# EAGLE schematic zoomm24_MRF_001 (EAGLE 5.11)

## Sheet 1 of 2
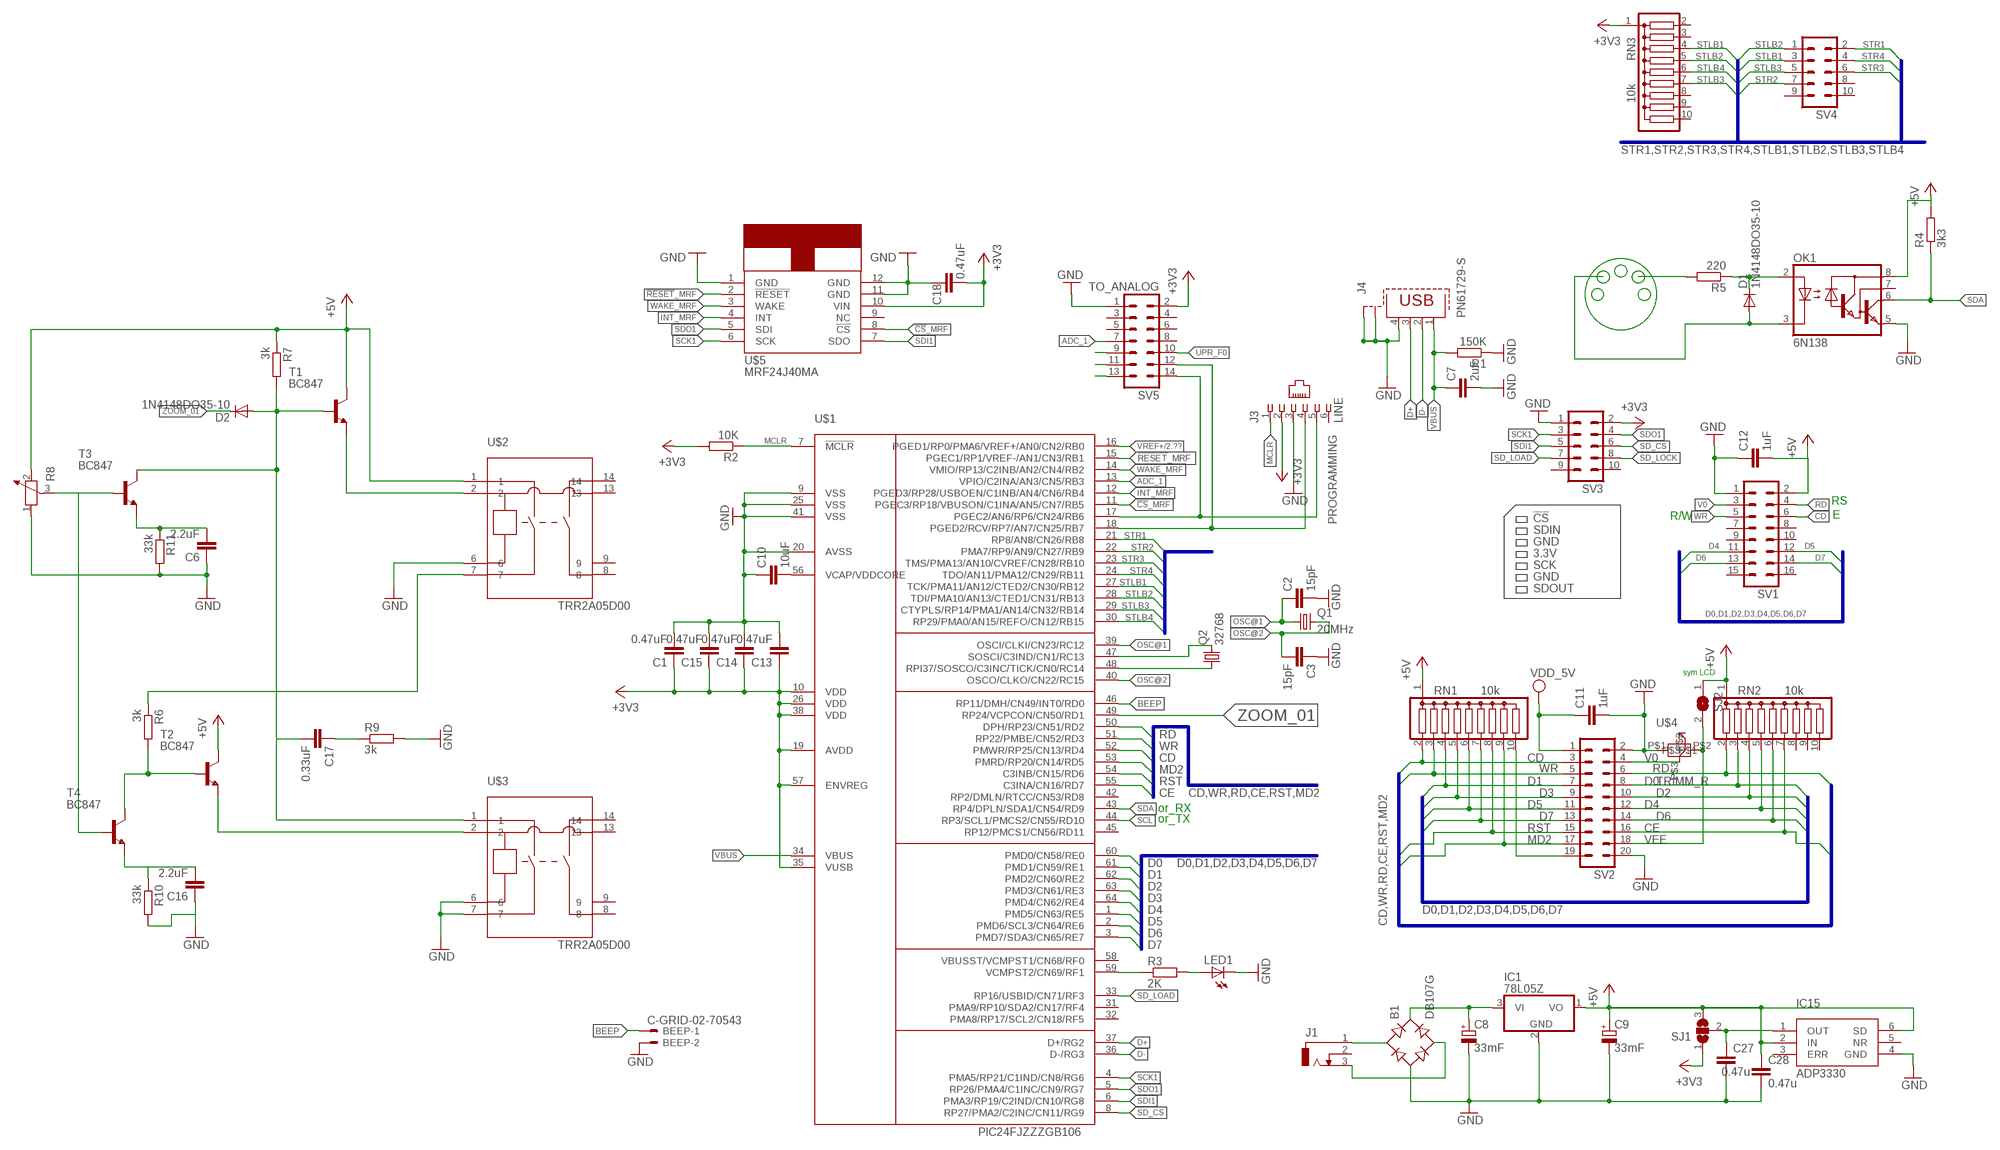
[diagram p0: schematic, sheet 1]

### Parts
B1  DB107G  [DB]
BEEP  C-GRID-02-70543  [70543-02]
C1  0.47uF  C-1206  [C1206]
C2  15pF  C-1206  [C1206]
C3  15pF  C-1206  [C1206]
C6  2.2uF  C-1206  [C1206]
C7  2uF  C-1206  [C1206]
C8  33mF  CPOL-EUE2.5-6  [E2,5-6]
C9  33mF  CPOL-EUE2.5-6  [E2,5-6]
C10  10uF  C-1206  [C1206]
C11  1uF  C-1206  [C1206]
C12  1uF  C-1206  [C1206]
C13  0.47uF  C-1206  [C1206]
C14  0.47uF  C-1206  [C1206]
C15  0.47uF  C-1206  [C1206]
C16  2.2uF  C-1206  [C1206]
C17  0.33uF  C-1206  [C1206]
C18  0.47uF  C-1206  [C1206]
C27  0.47u  C-EUC1206  [C1206]
C28  0.47u  C-EUC1206  [C1206]
D1  1N4148DO35-10  [DO35-10]
D2  1N4148DO35-10  [DO35-10]
IC1  78L05Z  [TO92]
IC15  ADP3330  [SOT-23-6]
J1  DCJ0303  [DCJ0303]
J3  LINE  520258-3  [520258-3]
J4  PN61729-S  [PN61729-S]
LED1  LED3MM  [LED3MM]
OK1  6N138  [DIL08]
Q1  20MHz  CRYSTALHC49S  [HC49/S]
Q2  32768  CRYSTALTC38H  [TC38H]
R1  150K  R-R1206  [R1206]
R2  10K  R-R1206  [R1206]
R3  2K  R-R1206  [R1206]
R4  3k3  R-EU_M1206  [M1206]
R5  220  R-EU_M1206  [M1206]
R6  3k  R-R1206  [R1206]
R7  3k  R-R1206  [R1206]
R8  POTENTIOMETER_PT-10  [PT-10]
R9  3k  R-R1206  [R1206]
R10  33k  R-R1206  [R1206]
R11  33k  R-R1206  [R1206]
RN1  10k  G09R  [SIL10]
RN2  10k  G09R  [SIL10]
RN3  10k  G09R  [SIL10]
SJ1  SJ2W  [SJ_2]
SJ2  SJ  [SJ]
SV1  ML16  [ML16]
SV2  ML20  [ML20]
SV3  ML10  [ML10]
SV4  ML10  [ML10]
SV5  TO_ANALOG  ML14  [ML14]
T1  BC847  [SOT23]
T2  BC847  [SOT23]
T3  BC847  [SOT23]
T4  BC847  [SOT23]
U$1  PIC24FJZZZGB106  [TQFP-64-PT-0.5MM]
U$2  TRR2A05D00  [TRR_DIP]
U$3  TRR2A05D00  [TRR_DIP]
U$4  TRIMM_R  [TRIMM_R]
U$5  MRF24J40MA  [MRF24J40MA]

### Nets
!CS!_MRF: U$1.11(PGEC3/RP18/VBUSON/C1INA/AN5/CN7/RB5) U$5.8(!CS)
!RESET!_MRF: U$1.15(PGEC1/RP1/VREF-/AN1/CN3/RB1) U$5.2(!RESET)
+3V3: C1.1 C13.1 C14.1 C15.1 C18.1 J3.2 R2.2 RN3.1 SJ1.1 SV3.2 SV5.2 U$1.10(VDD) U$1.19(AVDD) U$1.26(VDD) U$1.35(VUSB) U$1.38(VDD) U$1.57(ENVREG) U$5.10(VIN)
+5V: C9.+ C12.2 C28.1 IC1.1(VO) IC15.2(IN) IC15.6(SD) OK1.8(VCC) R4.2 R7.1 R8.2 RN1.1 RN2.1 SJ1.3 SJ2.1 SV1.2 T1.3(C) T2.3(C) U$2.1
ADC_1: SV5.7 U$1.13(VPIO/C2INA/AN3/CN5/RB3)
BEEP: BEEP.1 U$1.46(RP11/DMH/CN49/INT0/RD0)
CD: RN1.2 SV1.6 SV2.3 U$1.52(PMWR/RP25/CN13/RD4)
CE: RN2.7 SV2.16 U$1.55(C3INA/CN16/RD7)
CTR_0: SV5.9
CTR_1: SV5.11
CTR_2: SV5.13
D0: RN2.3 SV2.8 U$1.60(PMD0/CN58/RE0)
D1: RN1.4 SV2.7 U$1.61(PMD1/CN59/RE1)
D2: RN2.4 SV2.10 U$1.62(PMD2/CN60/RE2)
D3: RN1.5 SV2.9 U$1.63(PMD3/CN61/RE3)
D4: RN2.5 SV1.11 SV2.12 U$1.64(PMD4/CN62/RE4)
D5: RN1.6 SV1.12 SV2.11 U$1.1(PMD5/CN63/RE5)
D6: RN2.6 SV1.13 SV2.14 U$1.2(PMD6/SCL3/CN64/RE6)
D7: RN1.7 SV1.14 SV2.13 U$1.3(PMD7/SDA3/CN65/RE7)
D+: J4.3 U$1.37(D+/RG2)
D-: J4.2 U$1.36(D-/RG3)
GND: B1.- BEEP.2 C1.2 C2.2 C3.1 C6.1 C7.2 C8.- C9.- C10.1 C11.2 C12.1 C13.2 C14.2 C15.2 C16.1 C18.2 C27.2 C28.2 IC1.2(GND) IC15.4(GND) J3.3 J4.4 J4.S1 J4.S2 LED1.K(C) OK1.5(GND) R1.1 R8.1 R9.2 R10.2 R11.2 SV1.1 SV2.2 SV2.20 SV3.1 SV5.1 U$1.9(VSS) U$1.20(AVSS) U$1.25(VSS) U$1.41(VSS) U$2.6 U$3.6 U$3.7 U$4.P$1 U$5.1(GND) U$5.11(GND) U$5.12(GND) ; also sheet 2
INT_MRF: U$1.12(PGED3/RP28/USBOEN/C1INB/AN4/CN6/RB4) U$5.4(INT)
MCLR: J3.1 R2.1 U$1.7(!MCLR!)
MD2: RN1.9 SV2.17 U$1.53(PMRD/RP20/CN14/RD5)
N$1: T2.2(E) U$3.2
N$2: Q2.2 U$1.47(SOSCI/C3IND/CN1/RC13)
N$3: T1.2(E) U$2.2
N$4: D1.C OK1.2(A) R5.1
N$5: R5.2
N$6: D1.A OK1.3(C)
N$7: B1.AC1 J1.1
N$8: B1.AC2 J1.3
N$9: C17.2 D2.A R7.2 T1.1(B) T3.3(C) U$3.1
N$10: Q2.1 U$1.48(RPI37/SOSCO/C3INC/TICK/CN0/RC14)
N$11: C6.2 R11.1 T3.2(E)
N$12: C10.2 U$1.56(VCAP/VDDCORE)
N$13: C17.1 R9.1
N$14: RN1.10 SV2.19
N$15 [power]: B1.+ C8.+ IC1.3(VI)
N$16: R8.3 T3.1(B) T4.1(B)
N$17: R3.1 U$1.59(VCMPST2/CN69/RF1)
N$18: LED1.A R3.2
N$19: R6.1 U$2.7
N$20: R6.2 T2.1(B) T4.3(C)
N$21: C16.2 R10.1 T4.2(E)
OSC@1: C2.1 Q1.1 U$1.39(OSCI/CLKI/CN23/RC12)
OSC@2: C3.2 Q1.2 U$1.40(OSCO/CLKO/CN22/RC15)
RD: RN2.2 SV1.4 SV2.6 U$1.50(DPH/RP23/CN51/RD2)
RST: RN1.8 SV2.15 U$1.54(C3INB/CN15/RD6)
SCK1: SV3.3 U$1.4(PMA5/RP21/C1IND/CN8/RG6) U$5.6(SCK)
SCL: U$1.44(RP3/SCL1/PMCS2/CN55/RD10)
SD_CS: SV3.6 U$1.8(RP27/PMA2/C2INC/CN11/RG9)
SD_LOAD: SV3.7 U$1.33(RP16/USBID/CN71/RF3)
SD_LOCK: SV3.8
SDA: OK1.6(VO) R4.1 U$1.43(RP4/DPLN/SDA1/CN54/RD9)
SDI1: SV3.5 U$1.6(PMA3/RP19/C2IND/CN10/RG8) U$5.7(SDO)
SDO1: SV3.4 U$1.5(RP26/PMA4/C1INC/CN9/RG7) U$5.5(SDI)
STLB1: RN3.4 SV4.3 U$1.27(TCK/PMA11/AN12/CTED2/CN30/RB12)
STLB2: RN3.5 SV4.1 U$1.28(TDI/PMA10/AN13/CTED1/CN31/RB13)
STLB3: RN3.7 SV4.5 U$1.29(CTYPLS/RP14/PMA1/AN14/CN32/RB14)
STLB4: RN3.6 U$1.30(RP29/PMA0/AN15/REFO/CN12/RB15)
STR1: SV4.2 U$1.21(RP8/AN8/CN26/RB8)
STR2: SV4.7 U$1.22(PMA7/RP9/AN9/CN27/RB9)
STR3: SV4.6 U$1.23(TMS/PMA13/AN10/CVREF/CN28/RB10)
STR4: SV4.4 U$1.24(TDO/AN11/PMA12/CN29/RB11)
UPR_F0: SV5.10
UPR_K0: J3.5 SV5.14 U$1.17(PGEC2/AN6/RP6/CN24/RB6)
UPR_K1: J3.4 SV5.12 U$1.18(PGED2/RCV/RP7/AN7/CN25/RB7)
V0: SV1.3 SV2.4 U$4.P$3
VBUS: C7.1 J4.1 R1.2 U$1.34(VBUS)
VDD: C11.1 SV2.1 ; supply symbol labelled VDD_5V
VDD_: C27.1 IC15.1(OUT) SJ1.2
VEE: SJ2.2 SV2.18 U$4.P$2
VREF+ [net12]: U$1.16(PGED1/RP0/PMA6/VREF+/AN0/CN2/RB0) ; also sheet 2
WAKE_MRF: U$1.14(VMIO/RP13/C2INB/AN2/CN4/RB2) U$5.3(WAKE)
WR: RN1.3 SV1.5 SV2.5 U$1.51(RP22/PMBE/CN52/RD3)
ZOOM_01: D2.C U$1.49(RP24/VCPCON/CN50/RD1)
Unconnected: IC15.3(ERR) IC15.5(NR) J1.2 J3.6 OK1.7(VB) RN2.8 RN2.9 RN2.10 RN3.2 RN3.3 RN3.8 RN3.9 RN3.10 SV1.7 SV1.8 SV1.9 SV1.10 SV1.15 SV1.16 SV3.9 SV3.10 SV4.8 SV4.9 SV4.10 SV5.3 SV5.4 SV5.5 SV5.6 SV5.8 U$1.31(PMA9/RP10/SDA2/CN17/RF4) U$1.32(PMA8/RP17/SCL2/CN18/RF5) U$1.42(RP2/DMLN/RTCC/CN53/RD8) U$1.45(RP12/PMCS1/CN56/RD11) U$1.58(VBUSST/VCMPST1/CN68/RF0) U$2.8 U$2.9 U$2.13 U$2.14 U$3.8 U$3.9 U$3.13 U$3.14 U$5.9(NC)

### Buses
D0,D1,D2,D3,D4,D5,D6,D7
CD,WR,RD,CE,RST,MD2
STR1,STR2,STR3,STR4,STLB1,STLB2,STLB3,STLB4

### Notes on the sheet
- PROGRAMMING
- RS
- R/W | E
- !CS!
- SDIN
- GND
- 3.3V
- SCK
- GND
- SDOUT
- sym LCD
- or_RX
- or_TX

## Sheet 2 of 2
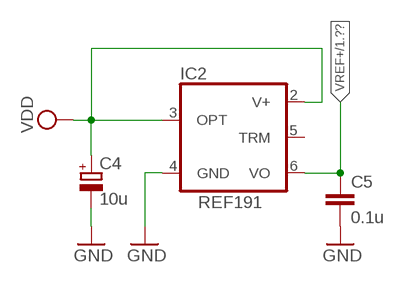
[diagram p1: schematic, sheet 2]

### Parts
C4  10u  CPOL-EUCT3528  [CT3528]
C5  0.1u  C-EUC1206  [C1206]
IC2  REF191  REF01D  [SO08]

### Nets
GND: C4.- C5.2 IC2.4(GND) ; also sheet 1
VDD_3V: C4.+ IC2.2(V+) IC2.3(OPT) ; supply symbol labelled VDD
VREF+ [net12]: C5.1 IC2.6(VO) ; also sheet 1
Unconnected: IC2.5(TRM)

## Library data of the parts
B1 = rectifier:DB?10*G: Single Phase 1.0 AMP Glass Passivated Bridge Rectifier Taiwan Semiconductor Co.,Ltd. - TSC Source: http://www.taiwansemi.com/TSCbig5/ezcatfiles/cust/img/img/db101g.pdf
BEEP = con-molex:C-GRID-02: CONNECTOR wire to board 2.54 mm (0.100") pitch header
C1-C3 C6 C7 C10-C18 = quantum-sensor:C: Capacitor
C4 C8 C9 = rcl:CPOL-EU: POLARIZED CAPACITOR, European symbol
C5 C27 C28 = rcl:C-EU: CAPACITOR, European symbol
D1 D2 = diode:1N4148: DIODE high speed (Philips)
IC1 = linear:78*: Positive VOLTAGE REGULATOR Source: http://cache.national.com/ds/LM/LM78L05.pdf http://www.fairchildsemi.com/ds/LM/LM7805.pdf
IC2 = linear:REF01: VOLTAGE REFERENCE
IC15 = raznoe01:ADP3330: adp3330
J1 = con-jack:DCJ0303: DC POWER JACK Source: DCJ0303.pdf
J3 = con-amp:520258-3: AMP connector
J4 = con-berg:PN61729-S: BERG USB connector
LED1 = led:LED: LED OSRAM: - CHIPLED LG R971, LG N971, LY N971, LG Q971, LY Q971, LO R971, LY R971 LH N974, LH R974 LS Q976, LO Q976, LY Q976 LO Q996 - Hyper CHIPLED LW Q18S LB Q993, LB Q99A, LB R99A - SideLED LS A670, LO A670, LY A670, LG A670, LP A670 LB A673, LV A673, LT A673, LW A673 LH A674 LY A675 LS A676, LA A676, LO A676, LY A676, LW A676 LS A679, LY A679, LG A679 - Hyper Micro SIDELED® LS Y876, LA Y876, LO Y876, LY Y876 LT Y87S - SmartLED LW L88C, LW L88S LB L89C, LB L89S, LG L890 LS L89K, LO L89K, LY L89K LS L896, LA L896, LO L896, LY L896 - TOPLED LS T670, LO T670, LY T670, LG T670, LP T670 LSG T670, LSP T670, LSY T670, LOP T670, LYG T670 LG T671, LOG T671, LSG T671 LB T673, LV T673, LT T673, LW T673 LH T674 LS T676, LA T676, LO T676, LY T676, LB T676, LH T676, LSB T676, LW T676 LB T67C, LV T67C, LT T67C, LS T67K, LO T67K, LY T67K, LW E67C LS E67B, LA E67B, LO E67B, LY E67B, LB E67C, LV E67C, LT E67C LW T67C LS T679, LY T679, LG T679 LS T770, LO T770, LY T770, LG T770, LP T770 LB T773, LV T773, LT T773, LW T773 LH T774 LS E675, LA E675, LY E675, LS T675 LS T776, LA T776, LO T776, LY T776, LB T776 LHGB T686 LT T68C, LB T68C - Hyper Mini TOPLED® LB M676 - Mini TOPLED Santana® LG M470 LS M47K, LO M47K, LY M47K Source: http://www.osram.convergy.de - LUMILED® LXK2-PW12-R00, LXK2-PW12-S00, LXK2-PW14-U00, LXK2-PW14-V00 LXK2-PM12-R00, LXK2-PM12-S00, LXK2-PM14-U00 LXK2-PE12-Q00, LXK2-PE12-R00, LXK2-PE12-S00, LXK2-PE14-T00, LXK2-PE14-U00 LXK2-PB12-K00, LXK2-PB12-L00, LXK2-PB12-M00, LXK2-PB14-N00, LXK2-PB14-P00, LXK2-PB14-Q00 LXK2-PR12-L00, LXK2-PR12-M00, LXK2-PR14-Q00, LXK2-PR14-R00 LXK2-PD12-Q00, LXK2-PD12-R00, LXK2-PD12-S00 LXK2-PH12-R00, LXK2-PH12-S00 LXK2-PL12-P00, LXK2-PL12-Q00, LXK2-PL12-R00 Source: www.luxeon.com
OK1 = optocoupler:6N138: MOTOROLA OPTO COUPLER
Q1 Q2 = crystal:CRYSTAL: CRYSTAL
R1-R3 R6 R7 R9-R11 = quantum-sensor:R: Resistor
R4 R5 = rcl:R-EU_: RESISTOR, European symbol
R8 = rcl:POTENTIOMETER_: Potentiometer
RN1-RN3 = resistor-sil:G09R: SIL RESISTOR
SJ1 = jumper:SJ2W: SMD solder JUMPER
SJ2 = jumper:SJ: SMD solder JUMPER
SV1 = con-ml:ML16: HARTING
SV2 = con-harting-ml:ML20: HARTING
SV3 SV4 = con-ml:ML10: HARTING
SV5 = con-ml:ML14: HARTING
T1-T4 = transistor:BC847: NPN TRANSISTOR
U$1 = microchip_pic24:PIC24FJZZZGB106: PIC24FJXXXGB106
U$2 U$3 = trr_rele:TRR2A05D00: trr trr2a trr2a05d00
U$4 = trimm_r:TRIMM_R: TRIMM resistor R TRIMM_R
U$5 = microchip_mrf24j40ma:MRF24J40MA: mrf24j40ma

## Net classes
1 power: width 0.813 mm
2 net12: width 0.305 mm
5 net16: width 0.406 mm
6 net8: width 0.203 mm